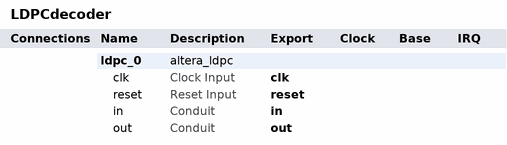
[diagram p0: system contents]
# Platform Designer (Qsys) system LDPCdecoder, Cyclone V 5CSEMA5F31C6
# Parameters at their usual value, and those the tool derives, are not listed.
package require -exact qsys 18.1
create_system LDPCdecoder
set_project_property DEVICE_FAMILY {Cyclone V}
set_project_property DEVICE 5CSEMA5F31C6

add_instance ldpc_0 altera_ldpc 18.1
set_instance_property ldpc_0 AUTO_EXPORT true
set_instance_parameter_value ldpc_0 ATTENUATION 1
set_instance_parameter_value ldpc_0 BITSPERSYMBOL 1
set_instance_parameter_value ldpc_0 CHANNEL 1
set_instance_parameter_value ldpc_0 CODE 0
set_instance_parameter_value ldpc_0 EXTRALATENCY 0
set_instance_parameter_value ldpc_0 ISFULLSTREAMING 1
set_instance_parameter_value ldpc_0 ISLAYERED 1
set_instance_parameter_value ldpc_0 ISVARRATE 0
set_instance_parameter_value ldpc_0 K 0
set_instance_parameter_value ldpc_0 LAYER 10.0
set_instance_parameter_value ldpc_0 LDPC_TYPE WiMedia
set_instance_parameter_value ldpc_0 LLRPERSYMBOL 2
set_instance_parameter_value ldpc_0 MODULE Decoder
set_instance_parameter_value ldpc_0 N 1
set_instance_parameter_value ldpc_0 NBCHECKGROUP 90
set_instance_parameter_value ldpc_0 NBVARGROUP 90
set_instance_parameter_value ldpc_0 NB_ITE 10
set_instance_parameter_value ldpc_0 PAR 2
set_instance_parameter_value ldpc_0 RATE 0
set_instance_parameter_value ldpc_0 S 4
set_instance_parameter_value ldpc_0 SOFTBITS 3
set_instance_parameter_value ldpc_0 TRANSMIT_PARITY 0
set_instance_parameter_value ldpc_0 design_env NATIVE
set_instance_parameter_value ldpc_0 selected_device_family {Cyclone V}

# exported interfaces
add_interface clk clock sink
set_interface_property clk EXPORT_OF ldpc_0.clk
add_interface in conduit end
set_interface_property in EXPORT_OF ldpc_0.in
add_interface out conduit end
set_interface_property out EXPORT_OF ldpc_0.out
add_interface reset reset sink
set_interface_property reset EXPORT_OF ldpc_0.reset

set_interconnect_requirement {$system} qsys_mm.clockCrossingAdapter HANDSHAKE
set_interconnect_requirement {$system} qsys_mm.enableEccProtection FALSE
set_interconnect_requirement {$system} qsys_mm.insertDefaultSlave FALSE
set_interconnect_requirement {$system} qsys_mm.maxAdditionalLatency 1

save_system LDPCdecoder.qsys
